# EAGLE design Placa Pic16F628 (EAGLE 7.1.0)
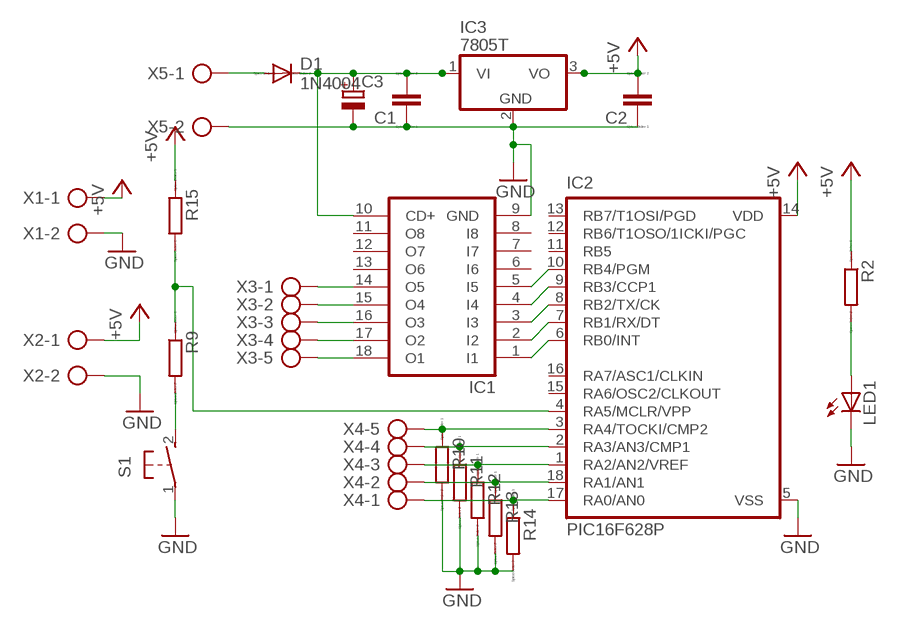
[diagram p0: schematic, sheet 1]

## Parts
C1  C-EU050-030X075  [C050-030X075]
C2  C-EU050-030X075  [C050-030X075]
C3  CPOL-EUB45181B  [B45181B]
D1  1N4004  [DO41-10]
IC1  ULN2803A  [DIL18]
IC2  PIC16F628P  [DIL18]
IC3  7805T  [TO220H]
LED1  LED5MM  [LED5MM]
R2  R-EU_0207_12  [0207/12]
R9  R-EU_0207_12  [0207/12]
R10  R-EU_0207_12  [0207/12]
R11  R-EU_0207_12  [0207/12]
R12  R-EU_0207_12  [0207/12]
R13  R-EU_0207_12  [0207/12]
R14  R-EU_0207_12  [0207/12]
R15  R-EU_0207_12  [0207/12]
S1  31-XX  [B3F-31XX]
X1  AK300/2  [AK300/2]
X2  AK300/2  [AK300/2]
X3  AK300/5  [AK300/5]
X4  AK300/5  [AK300/5]
X5  AK300/2  [AK300/2]

## Nets
+5V: C2.2 IC2.14(VDD) IC3.3(VO) R2.1 R15.1 X1.1 X2.1
GND: C1.1 C2.1 C3.- IC1.9(GND) IC2.5(VSS) IC3.2(GND) LED1.K(C) R10.2 R11.2 R12.2 R13.2 R14.2 S1.1(P) X1.2 X2.2 X5.2
N$1: IC1.1(I1) IC2.6(RB0/INT)
N$2: IC1.2(I2) IC2.7(RB1/RX/DT)
N$3: IC1.3(I3) IC2.8(RB2/TX/CK)
N$4: IC1.4(I4) IC2.9(RB3/CCP1)
N$5: IC1.5(I5) IC2.10(RB4/PGM)
N$7: IC2.3(RA4/TOCKI/CMP2) R10.1 X4.5
N$8: IC2.2(RA3/AN3/CMP1) R11.1 X4.4
N$9: IC2.1(RA2/AN2/VREF) R12.1 X4.3
N$10: IC2.18(RA1/AN1) R13.1 X4.2
N$11: LED1.A R2.2
N$12: D1.A X5.1
N$13: IC2.4(RA5/MCLR/VPP) R9.1 R15.2
N$14: R9.2 S1.2(S)
N$15: IC2.17(RA0/AN0) R14.1 X4.1
N$16: C1.2 C3.+ D1.C IC1.10(CD+) IC3.1(VI)
N$21: IC1.14(O5) X3.1
N$22: IC1.15(O4) X3.2
N$23: IC1.16(O3) X3.3
N$24: IC1.17(O2) X3.4
N$25: IC1.18(O1) X3.5
Unconnected: IC1.6(I6) IC1.7(I7) IC1.8(I8) IC1.11(O8) IC1.12(O7) IC1.13(O6) IC2.11(RB5) IC2.12(RB6/T1OSO/1ICKI/PGC) IC2.13(RB7/T1OSI/PGD) IC2.15(RA6/OSC2/CLKOUT) IC2.16(RA7/ASC1/CLKIN)

## Library data of the parts
C1 C2 = resistor:C-EU: CAPACITOR, European symbol; SPICEPREFIX: C
C3 = resistor:CPOL-EU: POLARIZED CAPACITOR, European symbol
D1 = diode:1N4004: DIODE general purpose rectifier, 1 A
IC1 = uln-udn:ULN2803A: DRIVER ARRAY
IC2 = microchip:PIC16*F62: FLASH-Based 8-Bit CMOS Microcontroller Source: http://ww1.microchip.com/downloads/en/DeviceDoc/40300C.pdf; MF: MICROCHIP; MPN: PIC16F628-20/P; OC_FARNELL: 9760423; OC_NEWARK: 23C4982
IC3 = linear:78*: Positive VOLTAGE REGULATOR Source: http://cache.national.com/ds/LM/LM78L05.pdf http://www.fairchildsemi.com/ds/LM/LM7805.pdf
LED1 = led:LED: LED OSRAM: - CHIPLED LG R971, LG N971, LY N971, LG Q971, LY Q971, LO R971, LY R971 LH N974, LH R974 LS Q976, LO Q976, LY Q976 LO Q996 - Hyper CHIPLED LW Q18S LB Q993, LB Q99A, LB R99A - SideLED LS A670, LO A670, LY A670, LG A670, LP A670 LB A673, LV A673, LT A673, LW A673 LH A674 LY A675 LS A676, LA A676, LO A676, LY A676, LW A676 LS A679, LY A679, LG A679 - Hyper Micro SIDELED® LS Y876, LA Y876, LO Y876, LY Y876 LT Y87S - SmartLED LW L88C, LW L88S LB L89C, LB L89S, LG L890 LS L89K, LO L89K, LY L89K LS L896, LA L896, LO L896, LY L896 - TOPLED LS T670, LO T670, LY T670, LG T670, LP T670 LSG T670, LSP T670, LSY T670, LOP T670, LYG T670 LG T671, LOG T671, LSG T671 LB T673, LV T673, LT T673, LW T673 LH T674 LS T676, LA T676, LO T676, LY T676, LB T676, LH T676, LSB T676, LW T676 LB T67C, LV T67C, LT T67C, LS T67K, LO T67K, LY T67K, LW E67C LS E67B, LA E67B, LO E67B, LY E67B, LB E67C, LV E67C, LT E67C LW T67C LS T679, LY T679, LG T679 LS T770, LO T770, LY T770, LG T770, LP T770 LB T773, LV T773, LT T773, LW T773 LH T774 LS E675, LA E675, LY E675, LS T675 LS T776, LA T776, LO T776, LY T776, LB T776 LHGB T686 LT T68C, LB T68C - Hyper Mini TOPLED® LB M676 - Mini TOPLED Santana® LG M470 LS M47K, LO M47K, LY M47K Source: http://www.osram.convergy.de LUXEON: - LUMILED® LXK2-PW12-R00, LXK2-PW12-S00, LXK2-PW14-U00, LXK2-PW14-V00 LXK2-PM12-R00, LXK2-PM12-S00, LXK2-PM14-U00 LXK2-PE12-Q00, LXK2-PE12-R00, LXK2-PE12-S00, LXK2-PE14-T00, LXK2-PE14-U00 LXK2-PB12-K00, LXK2-PB12-L00, LXK2-PB12-M00, LXK2-PB14-N00, LXK2-PB14-P00, LXK2-PB14-Q00 LXK2-PR12-L00, LXK2-PR12-M00, LXK2-PR14-Q00, LXK2-PR14-R00 LXK2-PD12-Q00, LXK2-PD12-R00, LXK2-PD12-S00 LXK2-PH12-R00, LXK2-PH12-S00 LXK2-PL12-P00, LXK2-PL12-Q00, LXK2-PL12-R00 Source: www.luxeon.com KINGBRIGHT: KA-3528ASYC Source: www.kingbright.com
R2 R9-R15 = resistor:R-EU_: RESISTOR, European symbol; SPICEPREFIX: R
S1 = switch-omron:31-XX: OMRON SWITCH; MPN: B3F-3100; OC_FARNELL: 959704; OC_NEWARK: 36M3582
X1 X2 X5 = con-ptr500:AK300/2: CONNECTOR; OC_FARNELL: unknown; OC_NEWARK: unknown
X3 X4 = con-ptr500:AK300/5: CONNECTOR; OC_FARNELL: unknown; OC_NEWARK: unknown

## Board
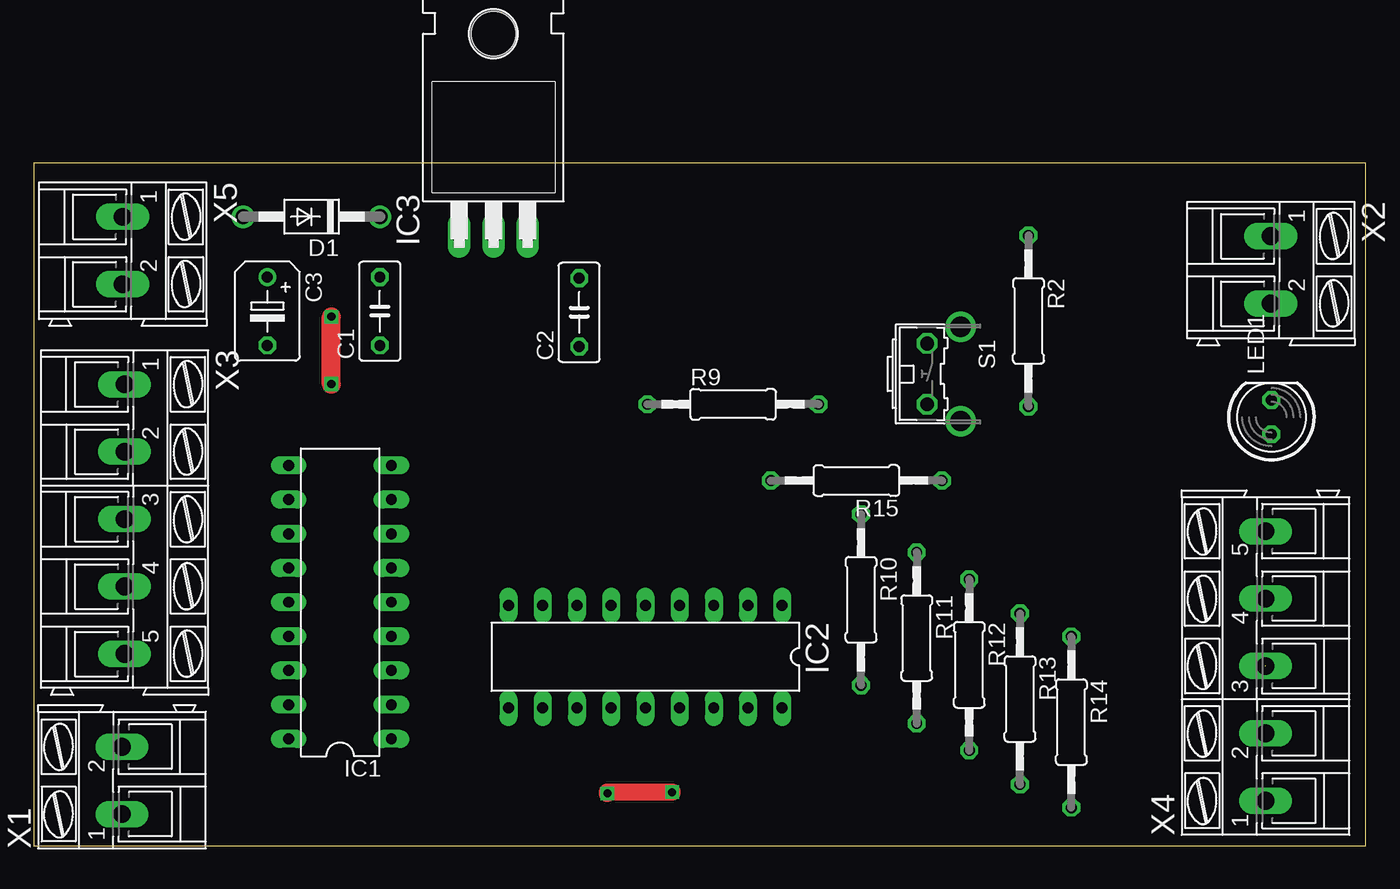
[diagram p1: board, top side]
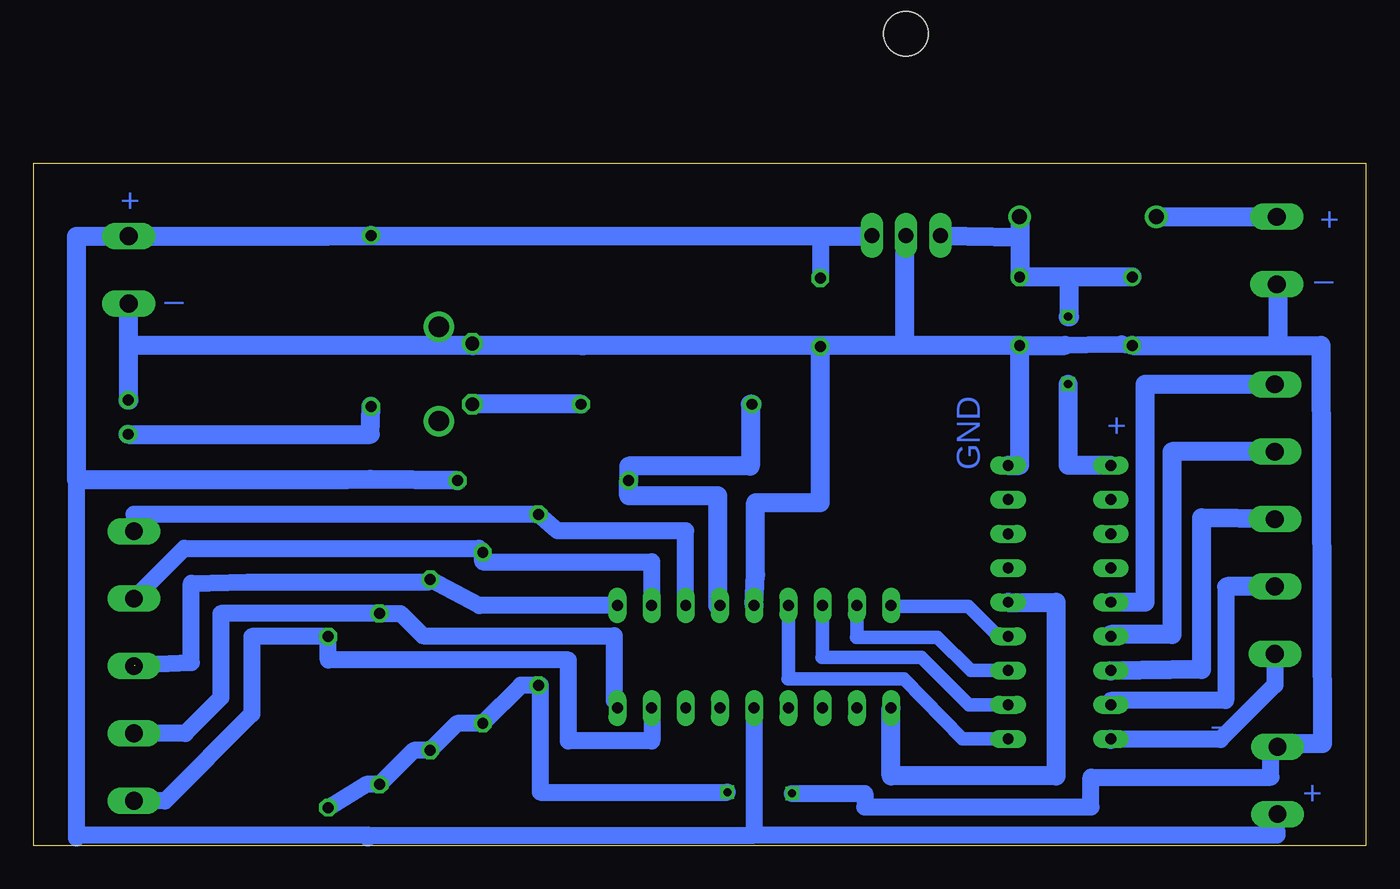
[diagram p2: board, bottom side, seen from below]

Size 98.9 x 50.7 mm. Coordinates in mm from the lower left corner, seen from the top.
Outline: 0,0 98.9,0 98.9,50.7 0,50.7 0,0
Copper layers (1*16): Top 0.035mm / dielectric 1.5mm / Bottom 0.035mm
Design rules "default": minimum track width 10mil, minimum drill 24mil, track to track 8mil, track to pad 8mil, pad to pad 8mil, via to via 8mil, smd to smd 8mil, copper to edge 40mil, drill to drill 8mil, minimum pad ring 10mil, minimum via ring 8mil, stop-mask expansion 4mil, vias tented up to drill 0mil, thermal gap 10mil

### Footprints (pad centres in the part's own frame; a part is rotated, then mirrored left to right if it is on the bottom)
C050-030X075 = drill 0.813 octagon: 1 -2.54,0; 2 2.54,0
B45181B = drill 0.813: + -2.54,0 | drill 0.813 octagon: - 2.54,0
DO41-10 = drill 1.118: A 5.08,0; C -5.08,0
DIL18 = drill 0.813 long: 1 -10.16,-3.81; 2 -7.62,-3.81; 3 -5.08,-3.81; 4 -2.54,-3.81; 5 0,-3.81; 6 2.54,-3.81; 7 5.08,-3.81; 8 7.62,-3.81; 9 10.16,-3.81; 10 10.16,3.81; 11 7.62,3.81; 12 5.08,3.81; 13 2.54,3.81; 14 0,3.81; 15 -2.54,3.81; 16 -5.08,3.81; 17 -7.62,3.81; 18 -10.16,3.81
TO220H = drill 1.118 long: 1 -2.54,-10.16; 2 0,-10.16; 3 2.54,-10.16 | hole 3.302: 0,4.826
LED5MM = drill 0.813 octagon: A -1.27,0; K 1.27,0
0207/12 = drill 0.813 octagon: 1 -6.35,0; 2 6.35,0
B3F-31XX = drill 1.016 octagon: 1 -2.261,-1.245; 2 2.261,-1.245 | drill 1.499 pad 2.159: 3 -3.505,1.245; 4 3.505,1.245
AK300/2 = drill 1.321 long: 1 -2.515,0; 2 2.489,0
AK300/5 = drill 1.321 long: 1 -10.008,0; 2 -5.004,0; 3 0,0; 4 5.004,0; 5 10.008,0

### Placement (x,y rotation side)
C1  25.7,39.71 90 top
C2  40.5,39.62 90 top
C3  17.35,39.71 270 top
D1  20.63,46.73 180 top
IC1  22.75,18.1 90 top
IC2  45.41,14.05 180 top
IC3  34.13,55.49 0 top
LED1  91.89,31.84 90 top
R2  73.86,38.98 270 top
R9  51.92,32.8 0 top
R10  61.42,18.28 270 top
R11  65.56,15.45 270 top
R12  69.46,13.45 270 top
R13  73.22,10.92 270 top
R14  77.03,9.2 270 top
R15  61.08,27.13 180 top
S1  67.58,35.05 270 top
X1  6.55,4.88 90 top
X2  91.84,42.76 270 top
X3  6.75,24.27 270 top
X4  91.45,13.36 90 top
X5  6.61,44.2 270 top

### Tracks (layer width: path | path; a pad name or v marks a point on that pad's centre or on a via)
+5V
  Bottom 1.27: 40.5,45.25 C2.2 | 95.71,0.8 95.71,27.6 | 74.07,0.7 74.1,0.8 | 74.1,0.8 74.1,0.6 | X1.1 6.7,2.37 6.6,0.8 45.41,0.8 | IC2.14 45.41,0.8 | 74.1,0.8 45.41,0.8 | 74.1,0.8 95.71,0.8 | 95.71,0.8 95.71,0.6
  Bottom 1.422: IC3.3 36.67,45.25 40.5,45.25 40.44,45.27 R2.1 77.1,45.28 X2.1 95.71,45.28 95.71,27.6 95.71,27.19 75.67,27.19 73.91,27.23 R15.1
GND  (via drill 0.6)
  Top 1.27: v47.4,4 42.6,4 v42.6,3.9
  Bottom 1.016: S1.1 66.34,37.18 66.3,37.14
  Bottom 1.27: C1.1 18.15,37.27 C3.- | R14.2 74.21,4.57 R13.2 70.69,7.1 R12.2 67.46,9.1 R11.2 62.72,11.93 R10.2 61.3,11.93 61.3,4 v47.4,4 | v42.6,3.9 37.2,3.9 37.2,2.9 20.4,2.9 20.4,5.1 7.05,5.1 7.05,7.6
  Bottom 1.422: X1.2 7.05,7.6 3.23,7.6 3.33,37.17 6.53,37.17 | 41.05,37.14 40.5,37.14 C2.1 40.5,25.5 45.3,25.5 45.3,20.16 IC2.5 | 41.05,37.14 58.2,37.14 | 58.2,37.14 58.09,37.16 | 58.2,37.14 66.3,37.14 91.84,37.14 | 91.84,37.14 X2.2 | LED1.K 91.84,33.11 91.84,37.14 | C3.- 6.53,37.17 | X5.2 6.53,41.71 6.53,37.17 | C1.1 34.24,37.17 | 34.24,37.17 41.05,37.17 41.05,37.14 | IC3.2 34.24,45.33 34.24,37.17 | C1.1 22.34,37.17 | IC1.9 25.7,28.26 C1.1
N$1
  Bottom 1.016: IC1.1 29.94,7.94 34.3,12.4 42.87,12.4 | 42.91,12.4 42.87,12.4 | 42.87,12.4 IC2.6
N$2
  Bottom 1.016: IC1.2 29.48,10.48 33,14 40.33,14 | 40.37,14 40.33,14 | 40.33,14 IC2.7
N$3
  Bottom 1.016: IC1.3 29.32,13.02 31.8,15.5 37.79,15.5 | 37.83,15.5 37.79,15.5 | 37.79,15.5 IC2.8
N$4
  Bottom 1.016: IC1.4 27.26,15.56 29.5,17.8 35.19,17.8 IC2.9
N$5
  Bottom 1.422: IC1.5 23,18.1 23,5.2 35.25,5.2 IC2.10
N$7
  Bottom 1.27: X4.5 91.45,24.63 R10.1 61.42,24.6 60,23.4 50.5,23.4 IC2.3
N$8
  Bottom 1.27: IC2.2 53.03,21.1 65.56,21.1 R11.1 65.86,22.1 87.71,22.1 X4.4 91.45,18.3
N$9  (1 unrouted)
  Bottom 1.27: 91.4,13.4 87.2,13.6 87.2,19.5 83,19.6 69.65,19.6 R12.1 65.82,17.86 IC2.1
N$10
  Bottom 1.27: IC2.18 55.57,10.8 55.8,10.8 55.8,15.6 70,15.6 71.67,17.27 R13.1 85,17.27 85,11 87.64,8.36 X4.2
N$11
  Bottom 1.422: LED1.A 73.92,30.57 R2.2
N$12
  Bottom 1.422: D1.A 6.61,46.73 X5.1
N$13
  Bottom 1.422: R9.1 45.7,32.8 45.7,28.2 54.73,28.2 R15.2 54.73,26 48.1,26 48.1,17.86 IC2.4
N$14
  Bottom 1.422: R9.2 S1.2
N$15
  Bottom 1.27: IC2.17 53,10.24 53,7.8 59.2,7.8 59.2,13.8 59.3,13.8 | X4.1 89.15,3.35 82.7,9.8 82.7,15.55 R14.1 77.03,13.8 59.3,13.8 | 59.3,13.8 59.3,13.7
N$16  (via drill 0.6)
  Top 1.422: v22.1,34.3 v22.1,39.3
  Bottom 1.422: C3.+ 22,42.25 | 22,42.25 C1.2 25.7,45.22 | D1.C 25.7,45.22 | IC3.1 25.7,45.22 | IC1.10 22.1,28.26 v22.1,34.3 | v22.1,39.3 22,39.3 22,42.25
N$21
  Bottom 1.422: X3.1 16.4,34.28 16.4,18.1 IC1.14
N$22
  Bottom 1.422: X3.2 14.4,29.27 14.4,15.7 18.94,15.7 IC1.15
N$23
  Bottom 1.422: X3.3 12.2,24.37 12.2,13.1 18.94,13 IC1.16
N$24
  Bottom 1.27: 10.3,19.27 10.4,19.27 10.4,10.8 18.94,10.8 IC1.17
  Bottom 1.422: X3.4 10.3,19.27 | 18.94,10.6 IC1.17
N$25
  Bottom 1.27: X3.5 6.75,11.95 10.8,7.9 18.89,7.9 IC1.18
  Bottom 1.422: X3.5 5.7,14.26 | 18.94,7.9 IC1.18

### Text on the board
Bottom: + | + | _ | _ | GND | + | _ | +